# EAGLE design psu_test (EAGLE 6.1)
Test
DOC_ID: CLK-SCH-52; DOC_PART_NO: TST-CLK-PC-03-PSU; DOC_REV: A; DOC_TITLE: PSU Test; PROJECT_NAME: ALARM CLOCK
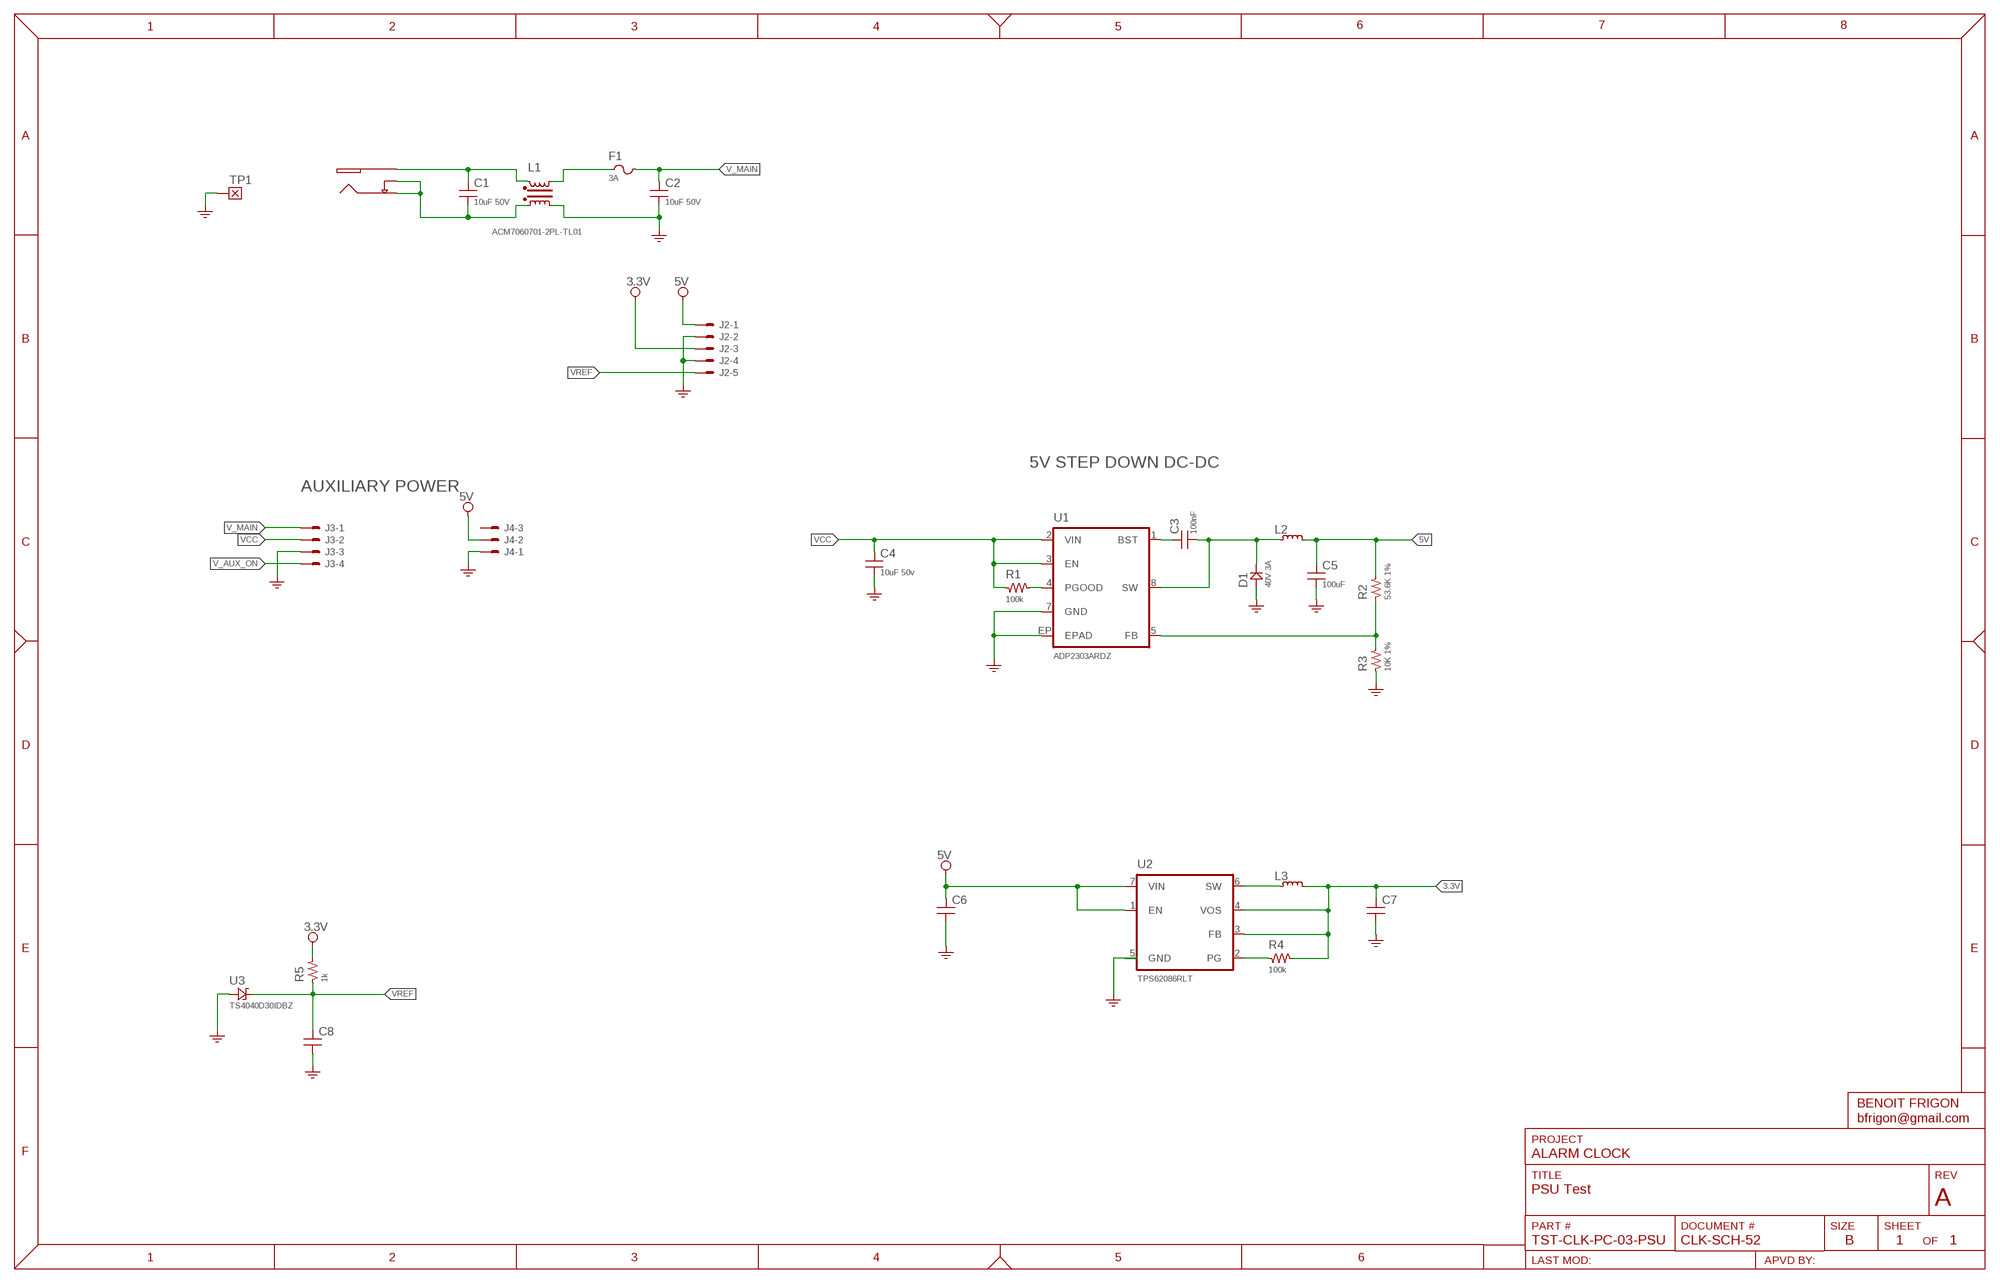
[diagram p0: schematic, sheet 1]
FRAME3 (FRAME_ANSI_B): SUBTITLE: POWER SUPPLY

## Parts
C1  10uF 50V  CAP-0805  [SMD_0805]
C2  10uF 50V  CAP-0805  [SMD_0805]
C3  100nF  CAP-0603  [SMD_0603]
C4  10uF 50v  CAP-1206  [SMD_1206]
C5  100uF  CAP-1206  [SMD_1206]
C6  CAP-1206  [SMD_1206]
C7  CAP-1206  [SMD_1206]
C8  CAP-0603  [SMD_0603]
D1  40V 3A  DIODE-DO214-AA  [DIODE_DO214-AA]
F1  3A  FUSE1206  [SMD_1206]
J1  CUI-PJ-013C  [CUI-PJ-013C]
J2  SNG-100-HEADER-05-HDR-V  [HDR_M_5]
J3  SNG-100-HEADER-04-HDR-V  [HDR_M_4]
J4  SNG-100-HEADER-03-HDR-V  [HDR_M_3]
L1  ACM7060701-2PL-TL01  CHOKE-ACM7060701-2PL-TL01  [ACM7060]
L2  IND-74437324022  [IND_4020]
L3  IND-MPI4040R2-R47-R  [IND_4045]
R1  100k  RES-0603  [SMD_0603]
R2  53.6K 1%  RES-0603  [SMD_0603]
R3  10K 1%  RES-0603  [SMD_0603]
R4  100k  RES-0603  [SMD_0603]
R5  1k  RES-0603  [SMD_0603]
TP1  TEST_POINT-TP_75X75  [TP_75X75]
U1  ADP2303ARDZ  [SOIC8-EP]
U2  TPS62086RLT  [QFN-7]
U3  TS4040D30IDBZ  [SOT23]

## Nets
3.3V [Power]: C7.1 J2.3 L3.2 R4.2 R5.2 U2.3(FB) U2.4(VOS)
5V [Power]: C5.1 C6.1 J2.1 J4.2 L2.2 R2.2 U2.1(EN) U2.7(VIN)
GND: C2.2 C4.2 C5.2 C6.2 C7.2 C8.2 D1.A J2.2 J2.4 J3.3 J4.1 L1.OA R3.1 TP1.1 U1.7(GND) U1.EP(EPAD) U3.2(A)
N$2: C1.2 J1.2(GND) J1.3(SW) L1.IA
N$3: R1.2 U1.4(PGOOD)
N$4: C1.1 J1.1(V+) L1.IB
N$11: C3.1 U1.1(BST)
N$32: F1.1 L1.OB
N$33: C3.2 D1.K L2.1 U1.8(SW)
N$34: R2.1 R3.2 U1.5(FB)
N$35: L3.1 U2.6(SW)
N$36: R4.1 U2.2(PG)
V_AUX_ON: J3.4
V_MAIN: C2.1 F1.2 J3.1
VCC: C4.1 J3.2 R1.1 U1.2(VIN) U1.3(EN)
VREF: C8.1 J2.5 R5.1 U3.1(K)
Unconnected: J4.3

## Notes on the sheet
- 5V STEP DOWN DC-DC
- AUXILIARY POWER

## Power pins joined to a net without a drawn wire
GND: U2.5(GND)

## Library data of the parts
C1 C2 = Passive:CAP: Capacitor; DESCRIPTION: {DESCRIPTION} - SMT 0805 - {value}; PACKAGE: SMT 0805
C3 C8 = Passive:CAP: Capacitor; DESCRIPTION: {DESCRIPTION} - SMT 0603 - {value}; PACKAGE: SMT 0603
C4-C7 = Passive:CAP: Capacitor; DESCRIPTION: {DESCRIPTION} - SMT 1206 - {value}; PACKAGE: SMT 1206
D1 = Passive:DIODE: Diode
F1 = Passive:FUSE: Fuse; DESCRIPTION: {DESCRIPTION} - SMT 1206 - {VALUE}
J1 = Connectors:CUI-PJ-013C
J2 = Connectors:SNG-100-HEADER-05: 5 Pos - Single Row - 2.54mm header; DESCRIPTION: {DESCRIPTION} - Male - Vertical
J3 = Connectors:SNG-100-HEADER-04: 4 Pos - Single Row - 2.54mm header
J4 = Connectors:SNG-100-HEADER-03: 3 Pos - Single Row - 2.54mm header
L1 = Passive:CHOKE-?*: Common mode choke; DESCRIPTION: {DESCRIPTION} - 4A; SKU: ACM7060-701-2PL-TL01
L2 = Passive:IND?*: Inductor; DESCRIPTION: {DESCRIPTION} - 22uH- 3.25A; MFG: Wurth Electronics Inc; SKU: 74437324022
L3 = Passive:IND?*: Inductor; DESCRIPTION: {DESCRIPTION} - 470nH - 6.4A; MFG: Cooper Bussmann; SKU: MPI4040R2-R47-R
R1-R5 = Passive:RES: Resistor; DESCRIPTION: {DESCRIPTION} - SMT 0603 - {VALUE}; PACKAGE: SMT 0603
TP1 = Misc:TEST_POINT; NO_BOM: 1
U1 = Power:ADP230?
U2 = Power:TPS6208*RLT: Step-Down Converter; DESCRIPTION: {DESCRIPTION} - 3.3v; MFG: Texas Instruments
U3 = Passive:TS4040

## Net classes
1 Power: width 0.406 mm, drill 0.457 mm, clearance 0.203 mm

## Board
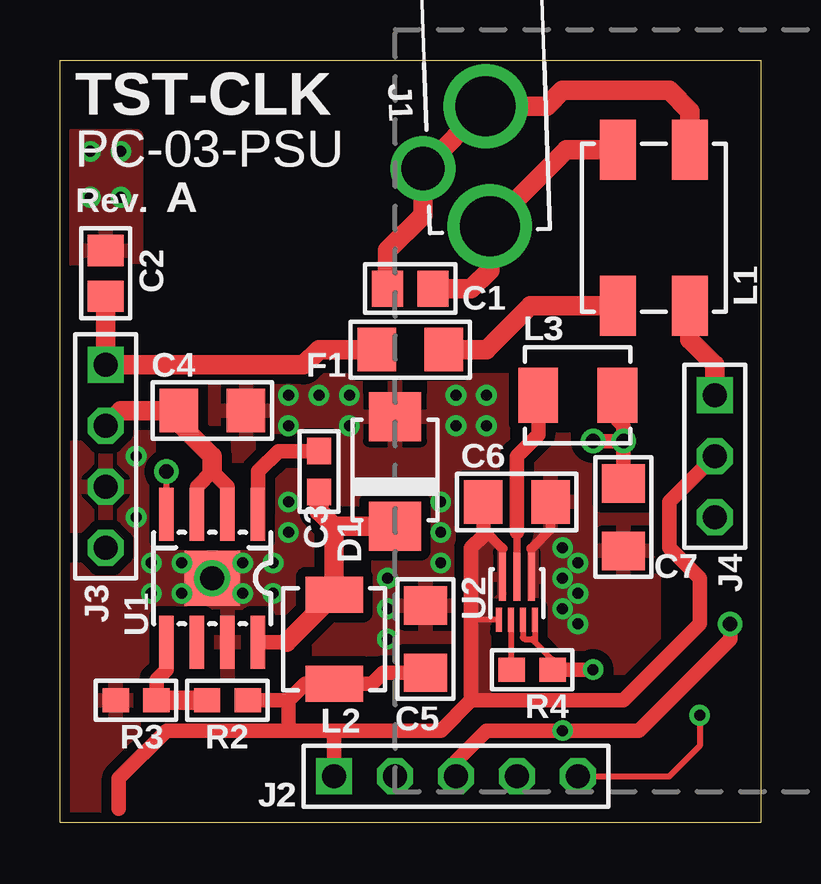
[diagram p1: board, top side]
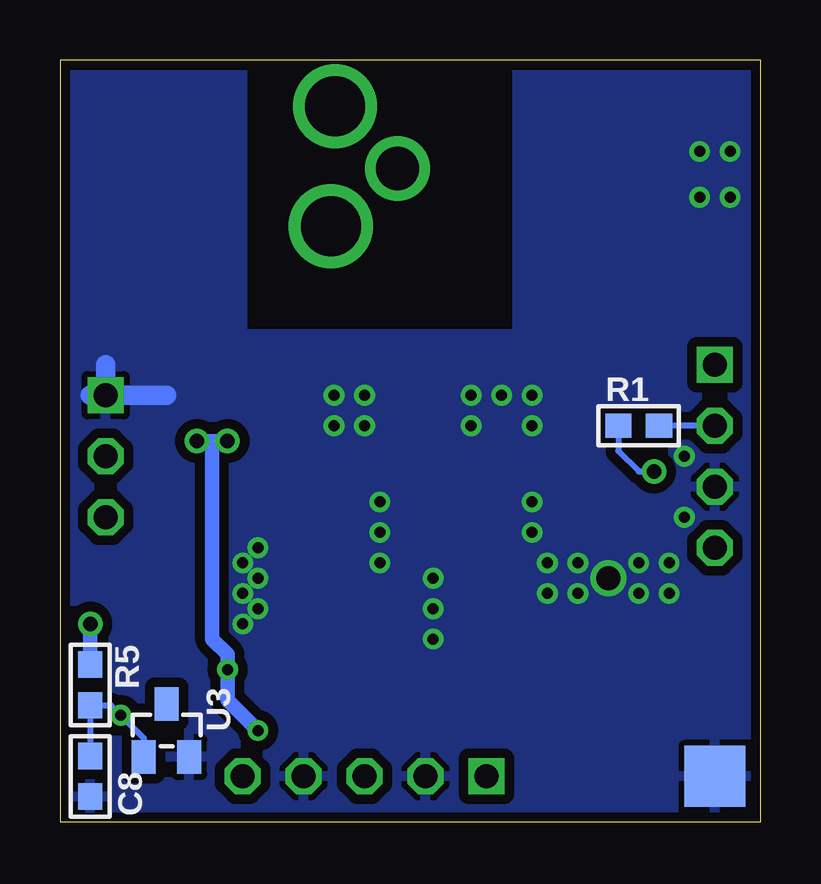
[diagram p2: board, bottom side, seen from below]

Size 29.21 x 31.75 mm. Coordinates in mm from the lower left corner, seen from the top.
Outline: 0,0 29.21,0 29.21,31.75 0,31.75 0,0
Copper layers (1*16): Top 0.035mm / dielectric 1.5mm / Bottom 0.035mm
Design rules: minimum track width 8mil, minimum drill 18mil, track to track 8mil, track to pad 8mil, pad to pad 8mil, via to via 8mil, smd to smd 6mil, copper to edge 15mil, drill to drill 8mil, minimum pad ring 10mil, minimum via ring 8mil, stop-mask expansion 4mil, vias tented up to drill 24mil, thermal gap 10mil
bRestrict: area 17.1,48.9 to 17.8,61

### Footprints (pad centres in the part's own frame; a part is rotated, then mirrored left to right if it is on the bottom)
SMD_0805 = smd 1.3 x 1.5: 1 -0.95,0; 2 0.95,0
SMD_0603 = smd 1.1 x 1: 1 -0.85,0; 2 0.85,0
SMD_1206 = smd 1.6 x 1.8: 1 -1.4,0; 2 1.4,0
DIODE_DO214-AA = smd 2.032 x 2.184: A -2.286,0; K 2.286,0
CUI-PJ-013C = drill 2.5: 1 11.2,0; 2 6.2,0 | drill 1.8: 3 8.7,-2.7
HDR_M_5 = drill 1 square: 1 0,0 | drill 1 octagon: 2 2.54,0; 3 5.08,0; 4 7.62,0; 5 10.16,0
HDR_M_4 = drill 1 square: 1 0,0 | drill 1 octagon: 2 2.54,0; 3 5.08,0; 4 7.62,0
HDR_M_3 = drill 1 square: 1 -2.54,0 | drill 1 octagon: 2 0,0; 3 2.54,0
ACM7060 = smd 2.5 x 1.5: IA -3.25,1.5; IB -3.25,-1.5; OA 3.25,1.5; OB 3.25,-1.5
IND_4020 = smd 1.5 x 2.4: 1 -1.85,0; 2 1.85,0
IND_4045 = smd 2.3 x 1.65: 1 0,1.65; 2 0,-1.65
TP_75X75 = smd 2.54 x 2.54: 1 0,0
SOIC8-EP = smd 0.6 x 2.2: 1 -1.905,-2.667; 2 -0.635,-2.667; 3 0.635,-2.667; 4 1.905,-2.667; 5 1.905,2.667; 6 0.635,2.667; 7 -0.635,2.667; 8 -1.905,2.667 | smd 2.3 x 2.3: EP 0,0
QFN-7 = smd 0.25 x 1: 1 -0.75,-1.1; 2 -0.25,-1.1; 3 0.25,-1.1; 4 0.75,-1.1 | smd 0.3 x 2: 5 0.6,0.7; 6 0,0.7; 7 -0.6,0.7
SOT23 = smd 1 x 1.4: 1 -0.95,-1.1; 2 0.95,-1.1; 3 0,1.1

### Placement (x,y rotation side)
C1  14.61,22.23 180 top
C2  1.91,22.86 90 top
C3  10.79,14.61 270 top
C4  6.35,17.14 0 top
C5  15.24,7.62 90 top
C6  19.05,13.34 0 top
C7  23.5,12.7 270 top
C8  27.94,1.91 270 bottom
D1  13.97,14.61 270 top
F1  14.61,19.68 180 top
J1  17.53,36.02 272 top
J2  11.43,1.91 0 top
J3  1.91,19.05 270 top
J4  27.3,15.24 270 top
L1  24.77,24.77 270 top
L2  11.43,7.62 270 top
L3  21.59,17.78 90 top
R1  5.08,16.51 180 bottom
R2  6.99,5.08 0 top
R3  3.17,5.08 0 top
R4  19.68,6.35 0 top
R5  27.94,5.71 90 bottom
TP1  1.91,1.91 0 bottom
U1  6.35,10.16 180 top
U2  19.05,9.53 0 top
U3  24.77,3.81 0 bottom
U$1  [INFO_COMPACT]  5.71,27.94 0 top

### Tracks (layer width: path | path; a pad name or v marks a point on that pad's centre or on a via)
3.3V  (via drill 0.46, 0.61)
  Top 0.254: U2.4 19.8,7.5 | 19.8,7.5 20.54,6.77 R4.2 | U2.3 19.3,7.69 19.37,7.62 19.68,7.62 19.8,7.5
  Top 0.61: C7.1 v23.5,15.88 | v23.5,15.88 v22.23,15.88 | v22.23,6.35 R4.2 | L3.2 23.24,16.77 23.5,16.51 v23.5,15.88 | J2.3 16.51,2.54 17.78,3.81 v20.95,3.81 24.13,3.81 27.94,7.62 v27.94,8.26
  Bottom 0.61: v22.23,15.88 22.86,15.88 | 22.86,15.88 v23.5,15.88 | 22.86,15.88 22.86,7.62 22.23,6.99 v22.23,6.35 22.23,5.08 v20.95,3.81 | R5.2 v27.94,8.26
5V
  Top 0.254: U2.1 17.14,8.43 17.14,8.89
  Top 0.305: U2.7 18.45,11.39
  Top 0.406: 18.45,11.39 17.65,12.2
  Top 0.61: C6.1 17.65,12.2 17.65,11.94 17.14,11.43 17.14,8.89 17.14,5.08 | 9.53,3.81 4.45,3.81 2.45,1.81 2.45,0.55 | 11.43,3.81 15.88,3.81 17.14,5.08 | 9.53,5.08 9.53,3.81 | 15.74,6.22 C5.1 13.46,6.22 13.02,5.77 L2.2 10.21,5.77 9.53,5.08 | 17.14,5.08 23.5,5.08 26.67,8.26 26.67,10.16 25.4,11.43 25.4,13.34 J4.2 | R2.2 9.53,5.08 | J2.1 11.43,3.81 | 11.43,3.81 9.53,3.81
  pour Top: 17.14,11.43 17.14,5.4 17.78,5.4 17.78,9.53 18.41,9.53 18.41,11.43 17.78,12.06
GND  (via drill 0.46, 1)
  Top 0.305: U2.5 19.65,11.39
  Top 0.406: 19.65,11.39 20.45,12.2 C6.2
  Top 0.813: L1.OA 26.27,20.09 27.3,19.05 J4.1
  Bottom 0.813: J4.1 27.94,17.78 | J4.1 24.77,17.78 | J4.1 27.3,19.05
  other vias: 8.89,10.79 9.53,12.06 9.53,17.78 10.79,17.78 7.62,10.79 3.81,9.53 8.89,9.53 20.95,10.16 9.53,13.34 3.81,10.79 5.08,10.79 1.27,26.04 2.54,26.04 2.54,27.94 1.27,27.94 7.62,9.53 3.17,12.7 6.35,10.16 5.08,9.53 20.95,8.89 3.17,15.24 21.59,8.26 20.95,11.43 12.06,17.78 16.51,17.78 17.78,17.78 16.51,16.51 17.78,16.51 15.88,10.79 13.65,7.62 15.88,12.06 15.88,13.34 13.65,8.89 13.65,10.16 21.59,10.79 21.59,9.53 12.06,16.51 9.53,16.51
  pour Bottom (isolate 0.406): 29.21,0 0,0 0,31.75 10.16,31.75 10.16,20.32 21.59,20.32 21.59,31.75 29.21,31.75
  pour Top (isolate 0.406): 0.64,0 0.64,18.41 24.77,18.41 24.77,5.08 5.71,5.08 2.54,1.91 2.54,0
  pour Top: 3.17,23.5 0,23.5 0,28.57 3.17,28.57
N$2
  Top 0.813: L1.IA 26.27,29.61 25.4,30.48 20.95,30.48 20.3,29.82 J1.2 15.15,27.23 J1.3 15.13,25.29 13.65,23.82 C1.2
N$3  (via drill 0.61)
  Top 0.254: U1.4 v4.45,14.61
  Bottom 0.254: R1.2 5.93,15.46 5.08,14.61 v4.45,14.61
N$4
  Top 0.813: L1.IB 21.11,28.02 J1.1 17.92,23 17.14,22.23 C1.1
N$11
  Top 0.61: C3.1 9.11,15.46 8.26,14.61 U1.1
N$32
  Top 0.813: L1.OB 19.61,21.52 17.78,19.68 F1.1
N$33
  Top 0.61: 9.45,7.49 U1.8
  Top 0.813: 11.43,12.32 L2.1 9.45,7.49 | D1.K 11.43,12.32 | C3.2 10.79,12.95 11.43,12.32
N$34
  Top 0.61: R3.2 4.03,5.93 4.45,6.35 U1.5
  Top 0.813: R2.1 R3.2
N$35
  Top 0.305: U2.6 19.05,12.06
  Top 0.61: L3.1 19.94,16.13 19.05,15.24 19.05,12.06
N$36
  Top 0.254: U2.2 18.8,6.35 R4.1
V_MAIN
  Top 0.813: F1.2 10.79,19.68 10.16,19.05 J3.1 C2.1
VCC
  Top 0.61: C4.1 4.95,17.02 | U1.3 5.71,13.97 6.35,14.61 6.99,13.97 U1.2 | 4.95,16.64 4.95,17.02 | 4.95,17.02 5.08,17.14
  Top 0.813: 4.95,16.64 6.35,15.24 6.35,14.61 | 5.08,17.14 2.54,17.14 J3.2
  Bottom 0.254: J3.2 R1.1
VREF  (via drill 0.46)
  Top 0.254: v26.67,4.45 26.67,3.17 25.4,1.91 J2.5
  Bottom 0.254: C8.1 R5.1 27.09,4.87 v26.67,4.45 25.71,3.49 U3.1

### Text on the board
_tsilk: TST-CLK | J1 | PC-03-PSU | Rev. | A | C2 | L1 | C1 | F1 | L3 | C4 | C6 | C3 | D1 | J4 | J3 | C7 | U1 | U2 | L2 | R4 | R3 | R2 | C5 | J2
_bsilk: R1 | R5 | U3 | C8